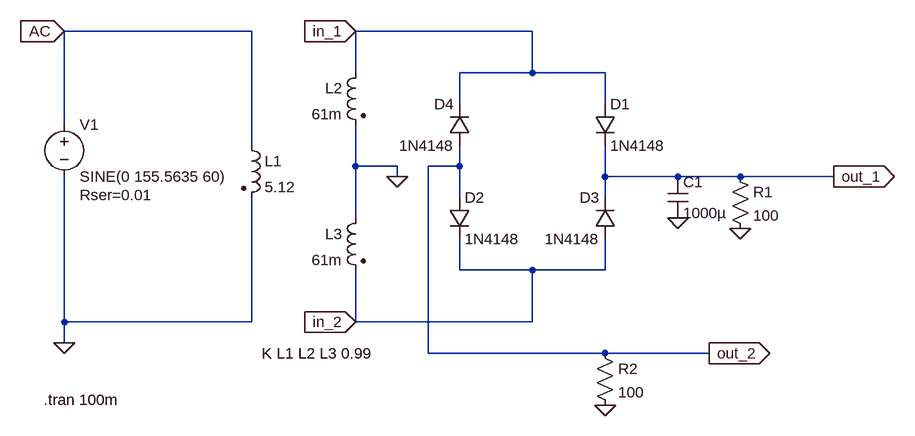
[diagram p0: schematic Diode_Rectifier.asc]
Diode_Rectifier.asc, the LTspice schematic file:
Version 4
SHEET 1 1352 680
WIRE 240 -192 -48 -192
WIRE 672 -192 400 -192
WIRE 400 -128 400 -192
WIRE 672 -128 672 -192
WIRE 672 -128 560 -128
WIRE 784 -128 672 -128
WIRE 560 -80 560 -128
WIRE 784 -80 784 -128
WIRE -48 -48 -48 -192
WIRE 240 -16 240 -192
WIRE 400 16 400 -48
WIRE 464 16 400 16
WIRE 560 16 560 -16
WIRE 560 16 512 16
WIRE 464 32 464 16
WIRE 784 32 784 -16
WIRE 896 32 784 32
WIRE 992 32 896 32
WIRE 1136 32 992 32
WIRE 560 64 560 16
WIRE 784 64 784 32
WIRE 400 96 400 16
WIRE 560 176 560 128
WIRE 672 176 560 176
WIRE 784 176 784 128
WIRE 784 176 672 176
WIRE -48 256 -48 32
WIRE 240 256 240 64
WIRE 240 256 -48 256
WIRE 400 256 400 176
WIRE 672 256 672 176
WIRE 672 256 400 256
WIRE -48 288 -48 256
WIRE 512 304 512 16
WIRE 784 304 512 304
WIRE 944 304 784 304
FLAG -48 288 0
FLAG 464 32 0
FLAG 400 -192 in_1
IOPIN 400 -192 In
FLAG 400 256 in_2
IOPIN 400 256 In
FLAG -48 -192 AC
IOPIN -48 -192 In
FLAG 1136 32 out_1
IOPIN 1136 32 Out
FLAG 944 304 out_2
IOPIN 944 304 Out
FLAG 992 112 0
FLAG 784 384 0
FLAG 896 96 0
SYMBOL voltage -48 -64 R0
WINDOW 123 0 0 Left 0
WINDOW 39 24 124 Left 2
SYMATTR SpiceLine Rser=0.01
SYMATTR InstName V1
SYMATTR Value SINE(0 155.5635 60)
SYMBOL ind2 224 -32 R0
SYMATTR InstName L1
SYMATTR Value 5.12
SYMATTR Type ind
SYMBOL ind2 416 -144 M0
SYMATTR InstName L2
SYMATTR Value 61m
SYMATTR Type ind
SYMBOL ind2 416 80 M0
SYMATTR InstName L3
SYMATTR Value 61m
SYMATTR Type ind
SYMBOL diode 768 -80 R0
SYMATTR InstName D1
SYMATTR Value 1N4148
SYMBOL diode 544 64 R0
SYMATTR InstName D2
SYMATTR Value 1N4148
SYMBOL diode 800 128 R180
WINDOW 0 24 64 Left 2
WINDOW 3 24 0 Left 2
SYMATTR InstName D3
SYMATTR Value 1N4148
SYMBOL diode 576 -16 R180
WINDOW 0 24 64 Left 2
WINDOW 3 24 0 Left 2
SYMATTR InstName D4
SYMATTR Value 1N4148
SYMBOL res 976 16 R0
SYMATTR InstName R1
SYMATTR Value 100
SYMBOL res 768 288 R0
SYMATTR InstName R2
SYMATTR Value 100
SYMBOL cap 880 32 R0
SYMATTR InstName C1
SYMATTR Value 1000µ
TEXT 256 304 Left 2 !K L1 L2 L3 0.99
TEXT -80 376 Left 2 !.tran 100m

The netlist it stands for:
* Diode_Rectifier.asc
V1 AC 0 SINE(0 155.5635 60) Rser=0.01
L1 AC 0 5.12
L2 in_1 0 61m
L3 0 in_2 61m
D1 in_1 out_1 1N4148
D2 out_2 in_2 1N4148
D3 in_2 out_1 1N4148
D4 out_2 in_1 1N4148
R1 out_1 0 100
R2 out_2 0 100
C1 out_1 0 1000µ
.model D D
.lib standard.dio
K L1 L2 L3 0.99
.tran 100m
.backanno
.end

* Results of the author's LTspice run, read from the files saved beside the schematic
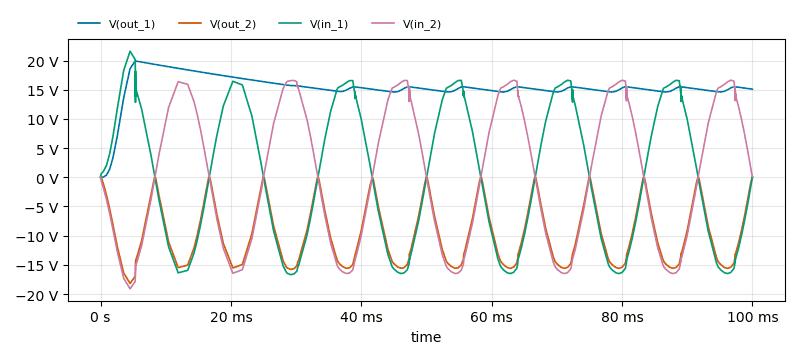
[diagram p1: Transient Analysis of Diode_Rectifier.asc, plotted from the saved traces]
* Transient Analysis, 1 run:
*   V(out_1): min 0 V, max 19.93 V, average 15.37 V, rms 15.59 V, last 15.1 V
*   V(out_2): min -18.18 V, max 182.4 µV, average -9.866 V, rms 11.14 V, last 44.87 µV
*   V(in_1): min -16.8 V, max 21.69 V, average -2.442 mV, rms 11.96 V, last 18.6 mV
*   V(in_2): min -19.11 V, max 16.8 V, average 893.1 µV, rms 11.91 V, last -14.37 mV